# Altium schematic sheet AUAV_X05_ToF.SchDoc
size A4
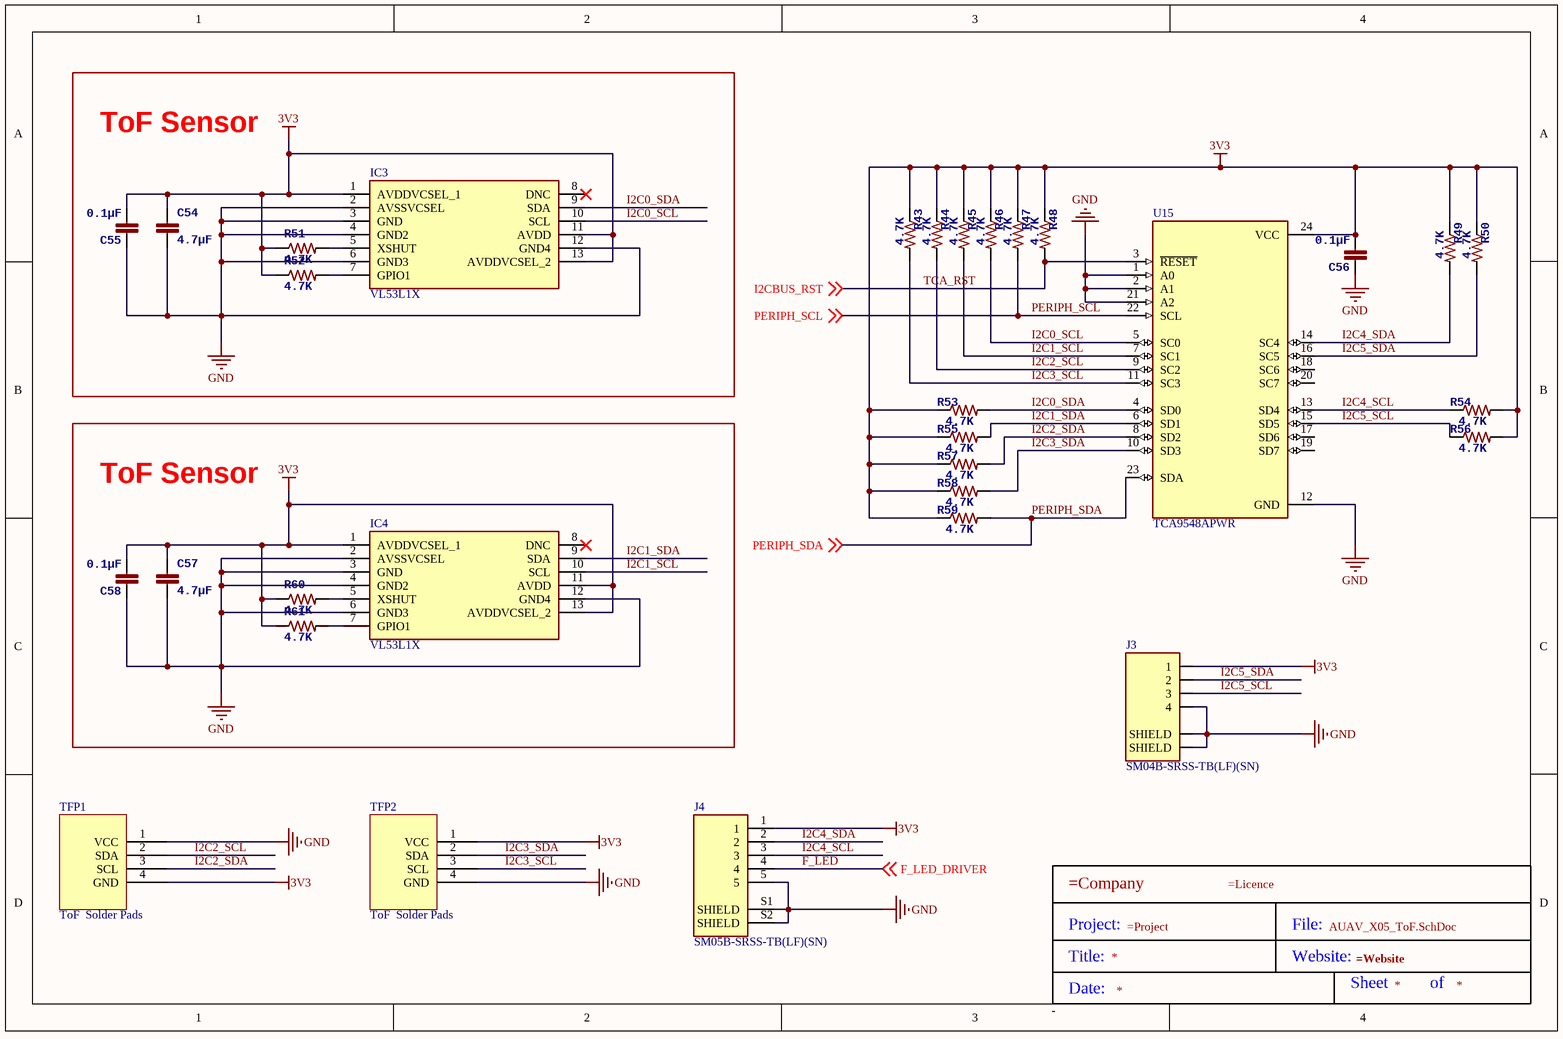
[diagram p0: AUAV_X05_ToF.SchDoc]

## Parts
*?  Title Block  (value not drawn)
C54  4.7µF  [0603-CAP]
C55  0.1µF  [0402-CAP]
C56  0.1µF  [0402-CAP]
C57  4.7µF  [0603-CAP]
C58  0.1µF  [0402-CAP]
IC3  VL53L1X  [VL53L1X]
IC4  VL53L1X  [VL53L1X]
J3  SM04B-SRSS-TB(LF)(SN)  [JST_SM04B-SRSS-TB(LF)(SN)]
J4  SM05B-SRSS-TB(LF)(SN)  [JST_SM05B-SRSS-TB(LF)(SN)]
R43  4.7K  [0402-RES]
R44  4.7K  [0402-RES]
R45  4.7K  [0402-RES]
R46  4.7K  [0402-RES]
R47  4.7K  [0402-RES]
R48  4.7K  [0402-RES]
R49  4.7K  [0402-RES]
R50  4.7K  [0402-RES]
R51  4.7K  [0402-RES]
R52  4.7K  [0402-RES]
R53  4.7K  [0402-RES]
R54  4.7K  [0402-RES]
R55  4.7K  [0402-RES]
R56  4.7K  [0402-RES]
R57  4.7K  [0402-RES]
R58  4.7K  [0402-RES]
R59  4.7K  [0402-RES]
R60  4.7K  [0402-RES]
R61  4.7K  [0402-RES]
TFP1  ToF  Solder Pads  [ToF Pads]
TFP2  ToF  Solder Pads  [ToF Pads]
U15  TCA9548APWR  [SOP65P640X120-24N]

## Blocks framed on the sheet
ToF Sensor: C54 C55 IC3 R51 R52
ToF Sensor: C57 C58 IC4 R60 R61

## Nets
3V3: C54.P$1 C55.P$2 C56.P$2 C57.P$1 C58.P$2 IC3.1(AVDDVCSEL_1) IC3.11(AVDD) IC3.13(AVDDVCSEL_2) IC4.1(AVDDVCSEL_1) IC4.11(AVDD) IC4.13(AVDDVCSEL_2) J3.1 J4.1 R43.P$1 R44.P$1 R45.P$1 R46.P$1 R47.P$1 R48.P$1 R49.P$1 R50.P$1 R51.P$1 R52.P$1 R53.P$1 R54.P$2 R55.P$1 R56.P$2 R57.P$1 R58.P$1 R59.P$1 R60.P$1 R61.P$1 TFP1.4(GND) TFP2.1(VCC) U15.24(VCC)
GND: C54.P$2 C55.P$1 C56.P$1 C57.P$2 C58.P$1 IC3.2(AVSSVCSEL) IC3.3(GND) IC3.4(GND2) IC3.6(GND3) IC3.12(GND4) IC4.2(AVSSVCSEL) IC4.3(GND) IC4.4(GND2) IC4.6(GND3) IC4.12(GND4) J3.4 J3.S1(SHIELD) J3.S2(SHIELD) J4.5 J4.S1(SHIELD) J4.S2(SHIELD) TFP1.1(VCC) TFP2.4(GND) U15.1(A0) U15.2(A1) U15.12(GND) U15.21(A2)
F_LED: J4.4 ; off-sheet F_LED_DRIVER  [also labelled F_LED_DRIVER]
I2C0_SCL: IC3.10(SCL) R46.P$2 U15.5(SC0)
I2C0_SDA: IC3.9(SDA) R53.P$2 U15.4(SD0)
I2C1_SCL: IC4.10(SCL) R45.P$2 U15.7(SC1)
I2C1_SDA: IC4.9(SDA) R55.P$2 U15.6(SD1)
I2C2_SCL: R44.P$2 TFP1.2(SDA) U15.9(SC2)
I2C2_SDA: R57.P$2 TFP1.3(SCL) U15.8(SD2)
I2C3_SCL: R43.P$2 TFP2.3(SCL) U15.11(SC3)
I2C3_SDA: R58.P$2 TFP2.2(SDA) U15.10(SD3)
I2C4_SCL: J4.3 R54.P$1 U15.13(SD4)
I2C4_SDA: J4.2 R49.P$2 U15.14(SC4)
I2C5_SCL: J3.3 R56.P$1 U15.15(SD5)
I2C5_SDA: J3.2 R50.P$2 U15.16(SC5)
PERIPH_SCL: R47.P$2 U15.22(SCL) ; off-sheet PERIPH_SCL
PERIPH_SDA: R59.P$2 U15.23(SDA) ; off-sheet PERIPH_SDA
TCA_RST: R48.P$2 U15.3(~{RESET}) ; off-sheet I2CBUS_RST  [also labelled I2CBUS_RST]
NetIC3_5: IC3.5(XSHUT) R51.P$2
NetIC3_7: IC3.7(GPIO1) R52.P$2
NetIC4_5: IC4.5(XSHUT) R60.P$2
NetIC4_7: IC4.7(GPIO1) R61.P$2

Not connected (* = marked no-connect by the designer): IC3 8(DNC)*; IC4 8(DNC)*; U15 17(SD6) 18(SC6) 19(SD7) 20(SC7)

## Notes on the sheet
- (in symbol Title Block) Project:; File:; Title:; Website:; Sheet; of; Date:

## Library data of the parts
C54 C57 = CAP0603: CAP CER 2.2UF 16V 10% X6S 0603; PARTNO: C1608X6S1C225K080AC; 3DR_PARTNO: ECM0619; Value: 2u2; Supplier 1: Digi-Key; Supplier Part Number 1: 445-7438-1-ND
C55 C56 C58 = CAP0402: CAP CER 8PF 50V C0G 0402; PARTNO: C1005C0G1H080C; 3DR_PARTNO: ECM0710; Value: 8p; Supplier 1: Digi-Key; Supplier Part Number 1: 445-4890-1-ND
IC3 IC4 = VL53L1X: Integrated Circuit; Manufacturer_Name: STMicroelectronics; Datasheet Link: https://www.st.com/resource/en/datasheet/vl53l1x.pdf; Height: 1.6mm; Manufacturer_Part_Number: VL53L1X
J3 = SM04B-SRSS-TB(LF)(SN): Connector Header Surface Mount, Right Angle 4 position 0.039 _1.00mm_; MF: JST Sales; MP: SM04B-SRSS-TB_LF__SN_; Price: None; SnapEDA_Link: https://www.snapeda.com/parts/SM04B-SRSS-TB%28LF%29%28SN%29/JST%20Sales%20America%20Inc./view-part/557466/?ref=snap; Value: *; Availability: Unavailable; Package: None
J4 = SM05B-SRSS-TB(LF)(SN): Connector Header Surface Mount, Right Angle 5 position 0.039 (1.00mm); MF: JST Sales; Price: None; Value: *; Availability: In Stock; Check_prices: https://www.snapeda.com/parts/SM05B-SRSS-TB(LF)(SN)/JST+Sales+America+Inc./view-part/?ref=eda; SnapEDA_Link: https://www.snapeda.com/parts/SM05B-SRSS-TB(LF)(SN)/JST+Sales+America+Inc./view-part/?ref=snap; MP: SM05B-SRSS-TB(LF)(SN); Package: None
R43-R61 = RESISTOR0402-RES: RES 10K OHM 1/16W 1% 0402 SMD; PARTNO: RC0402FR-0710KL; 3DR_PARTNO: ECM0800; Supplier 1: Digi-Key; Value: 10K; Supplier Part Number 1: 311-10.0KLRCT-ND
U15 = TCA9548APWR: Low-Voltage 8-Channel I2C Switch With Reset; MF: Texas Instruments; MP: TCA9548APWR; Price: None; DigiKey-Purchase-URL: https://snapeda.com/shop?store=DigiKey&id=280817; Package: TSSOP-24 Texas Instruments; Mouser-Purchase-URL: https://snapeda.com/shop?store=Mouser&id=280817; Texas_Instruments-Purchase-URL: https://snapeda.com/shop?store=Texas+Instruments&id=280817; Value: *; Availability: Unavailable; Arrow_Electronics-Purchase-URL: https://snapeda.com/shop?store=Arrow+Electronics&id=280817; SnapEDA_Link: https://www.snapeda.com/parts/TCA9548APWR/Texas%20Instruments/view-part/280817/?ref=snap
*? = Title Block: Size: -